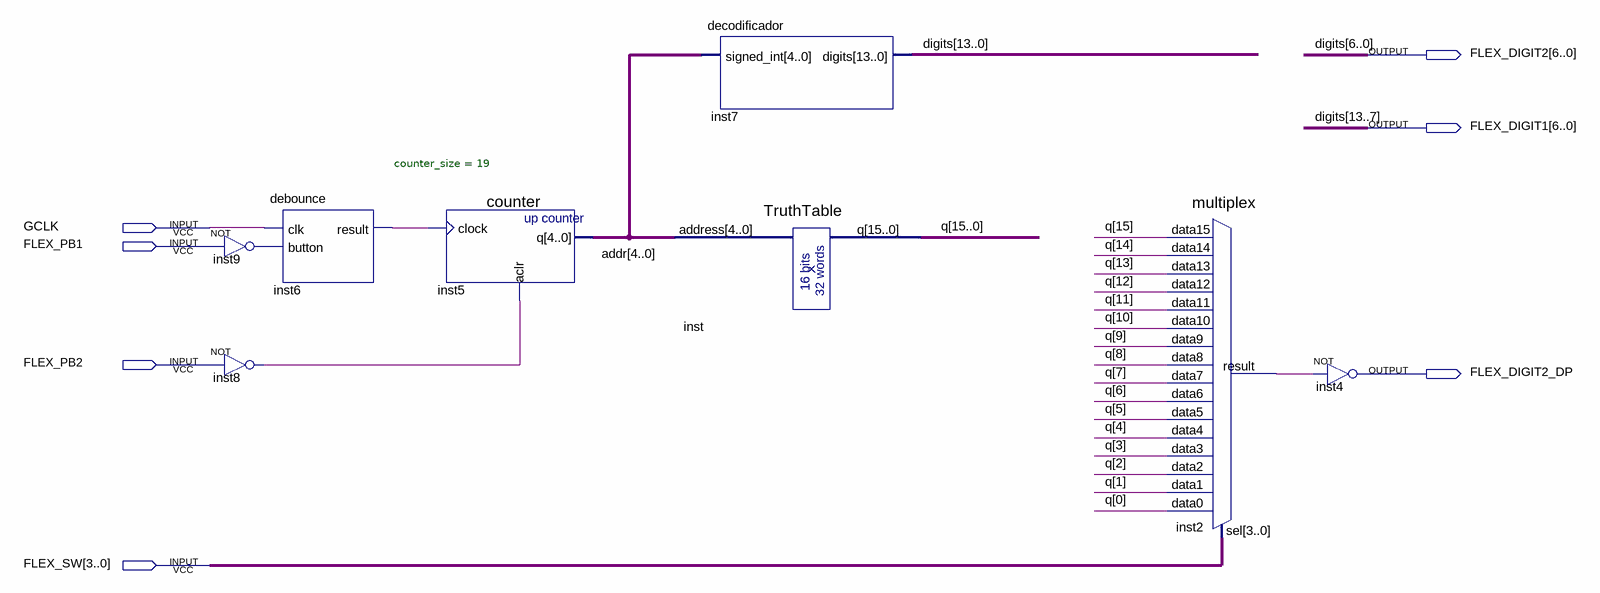
[diagram p0: schematic sheet]
// Quartus schematic multiplexador.bdf as structural Verilog: 8 symbols, 7 pins
module multiplexador (
  input  GCLK,
  input  FLEX_PB1,
  input  FLEX_PB2,
  input  [3:0] FLEX_SW,
  output [6:0] FLEX_DIGIT2,
  output [6:0] FLEX_DIGIT1,
  output FLEX_DIGIT2_DP
);

  wire inst2_result, inst6_result, inst8_out, inst9_out;
  wire [4:0] addr;
  wire [15:0] q;

  debounce #(.counter_size(19)) inst6 (.clk(GCLK), .button(inst9_out), .result(inst6_result));
  not inst9 (inst9_out, FLEX_PB1);
  not inst8 (inst8_out, FLEX_PB2);
  counter inst5 (.clock(inst6_result), .aclr(inst8_out), .q(addr));
  decodificador inst7 (.signed_int(addr), .digits({FLEX_DIGIT1, FLEX_DIGIT2}));
  TruthTable inst (.address(addr), .q(q));
  multiplex inst2 (
    .data15(q[15]), .data14(q[14]), .data13(q[13]), .data12(q[12]), .data11(q[11]), .data10(q[10]),
    .data9(q[9]), .data8(q[8]), .data7(q[7]), .data6(q[6]), .data5(q[5]), .data4(q[4]), .data3(q[3]),
    .data2(q[2]), .data1(q[1]), .data0(q[0]), .sel(FLEX_SW), .result(inst2_result));
  not inst4 (FLEX_DIGIT2_DP, inst2_result);

  // Other names for the same wires on the sheet: digits[13:0] = {FLEX_DIGIT1, FLEX_DIGIT2}
endmodule
